# Altium schematic sheet PM3_Bosclone_FPGA_1.SchDoc
size 282 x 200 mm
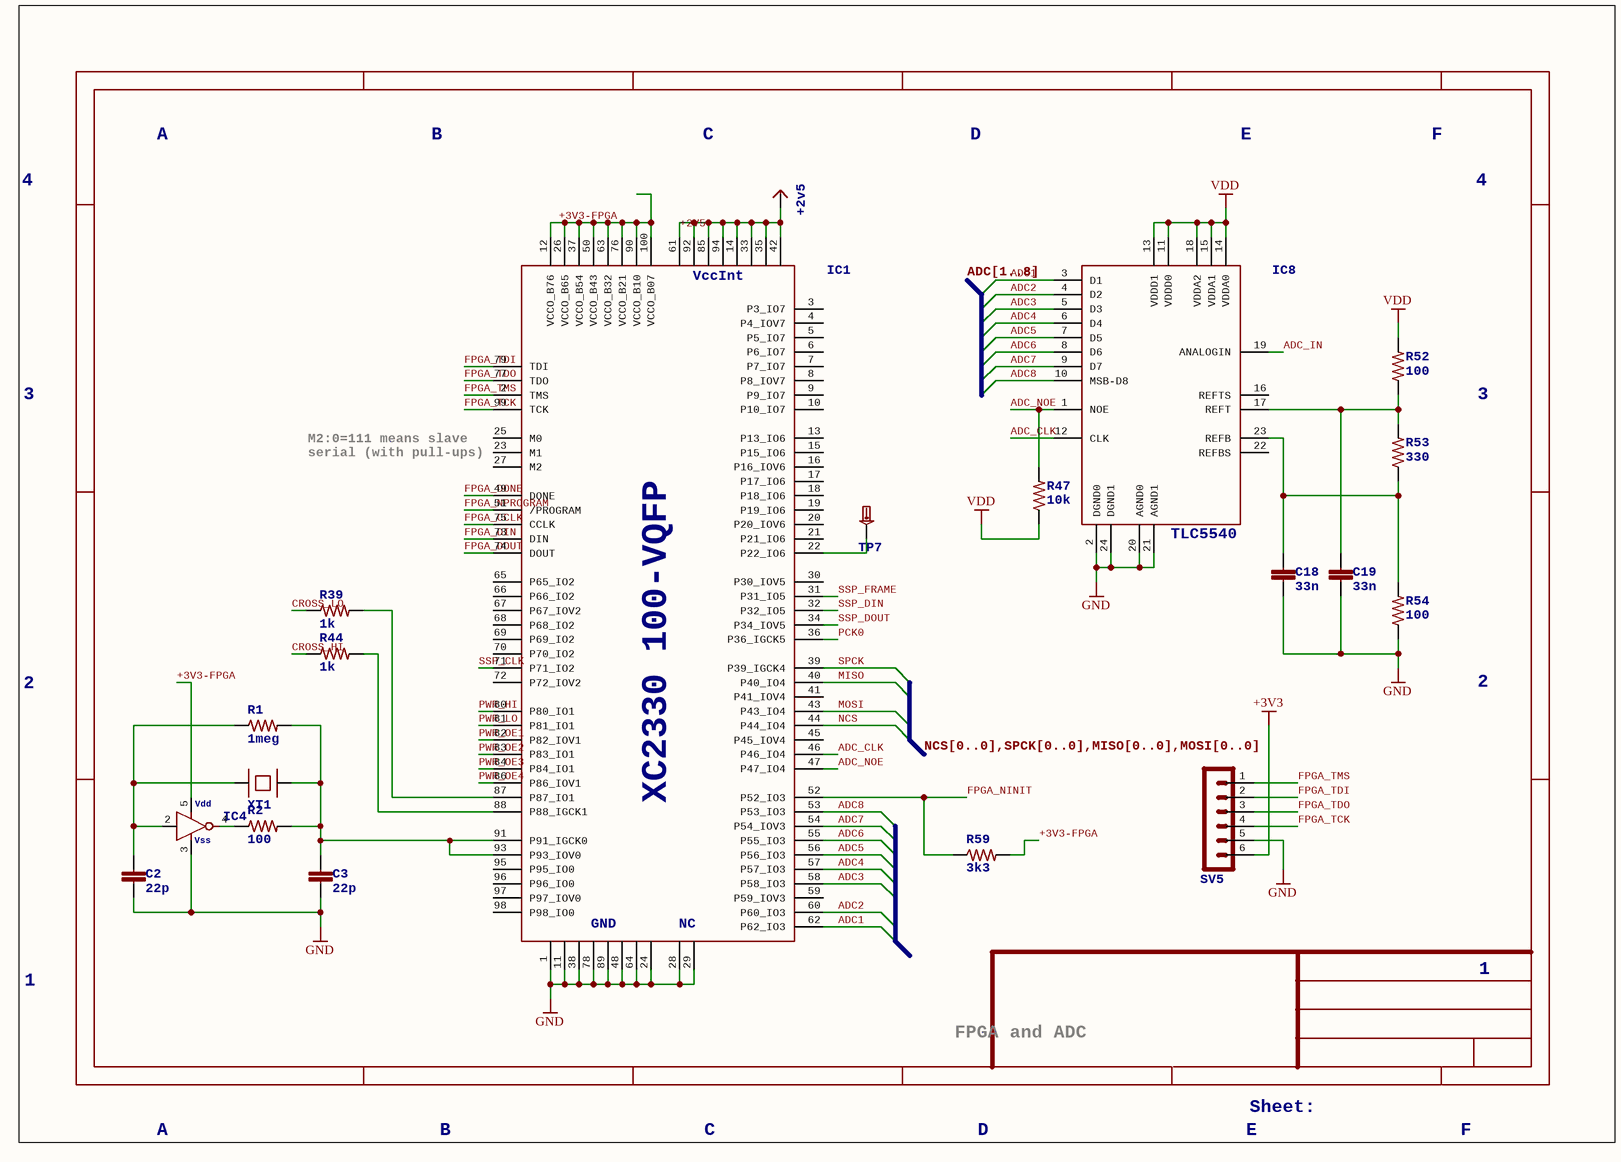
[diagram p0: PM3_Bosclone_FPGA_1.SchDoc]

## Parts
C2  22p  [RLC_0603]
C3  22p  [RLC_0603]
C18  33n  [RLC_0603]
C19  33n  [RLC_0603]
IC1  XC2330100-VQFP: XC2330 100-VQFP  [VQFP-100]  (hidden comment: SPARTAN-II-XC2S30-100-VQFP)
IC4  HCU-INVERTER  [SMV-5]  (value not drawn)
IC8  TLC5540  [TSSOP-24]
R1  1meg  [RLC_0603]
R2  100  [RLC_0603]
R39  1k  [RLC_0603]
R44  1k  [RLC_0603]
R47  10k  [RLC_0603]
R52  100  [RLC_0603]
R53  330  [RLC_0603]
R54  100  [RLC_0603]
R59  3k3  [RLC_0603]
SV5  HEADER-MALE-6X1  [HEADER-MALE-6X1-0.100-UNKEYED]  (value not drawn)
TP7  TESTPADKEYSTONE-SMD  [KEYSTONE-SMD-TESTPOINT-5015]  (value not drawn)
V4  SUPPLY_2V5  (value not drawn)
XT1  XTAL-SMD-CITIZEN-CS10  [XTAL-SMD-CITIZEN-CS10]  (value not drawn)

## Nets
+3V3: SV5.6
GND: C2.2 C3.2 C18.2 C19.2 IC1.1(GND1) IC1.11(GND2) IC1.24(GND8) IC1.28(NC0) IC1.29(NC1) IC1.38(GND3) IC1.48(GND6) IC1.64(GND7) IC1.78(GND4) IC1.89(GND5) IC4.3(VSS) IC8.2(DGND0) IC8.20(AGND0) IC8.21(AGND1) IC8.24(DGND1) R54.1 SV5.5
VDD: IC8.11(VDDD0) IC8.13(VDDD1) IC8.14(VDDA0) IC8.15(VDDA1) IC8.18(VDDA2) R47.1 R52.2
+2V5: IC1.14(VCCINT5) IC1.33(VCCINT6) IC1.35(VCCINT7) IC1.42(VCCINT8) IC1.61(VCCINT1) IC1.85(VCCINT3) IC1.92(VCCINT2) IC1.94(VCCINT4) V4.?1(+2V5)
+3V3-FPGA: IC1.12(VCCO_B76) IC1.26(VCCO_B65) IC1.37(VCCO_B54) IC1.50(VCCO_B43) IC1.63(VCCO_B32) IC1.76(VCCO_B21) IC1.90(VCCO_B10) IC1.100(VCCO_B07) IC4.5(VDD) R59.2
ADC1: IC1.62(P62_IO3) IC8.3(D1)
ADC2: IC1.60(P60_IO3) IC8.4(D2)
ADC3: IC1.58(P58_IO3) IC8.5(D3)
ADC4: IC1.57(P57_IO3) IC8.6(D4)
ADC5: IC1.56(P56_IO3) IC8.7(D5)
ADC6: IC1.55(P55_IO3) IC8.8(D6)
ADC7: IC1.54(P54_IOV3) IC8.9(D7)
ADC8: IC1.53(P53_IO3) IC8.10(MSB-D8)
ADC_CLK: IC1.46(P46_IO4) IC8.12(CLK)
ADC_IN: IC8.19(ANALOGIN)
ADC_NOE: IC1.47(P47_IO4) IC8.1(NOE) R47.2
CROSS_HI: R44.1
CROSS_LO: R39.1
FPGA_CCLK: IC1.75(CCLK)
FPGA_DIN: IC1.73(DIN)
FPGA_DONE: IC1.49(DONE)
FPGA_DOUT: IC1.74(DOUT)
FPGA_NINIT: IC1.52(P52_IO3) R59.1
FPGA_NPROGRAM: IC1.51(/PROGRAM)
FPGA_TCK: IC1.99(TCK) SV5.4
FPGA_TDI: IC1.79(TDI) SV5.2
FPGA_TDO: IC1.77(TDO) SV5.3
FPGA_TMS: IC1.2(TMS) SV5.1
MISO: IC1.40(P40_IO4)
MOSI: IC1.43(P43_IO4)
NCS: IC1.44(P44_IO4)
PCK0: IC1.36(P36_IGCK5)
PWR_HI: IC1.80(P80_IO1)
PWR_LO: IC1.81(P81_IO1)
PWR_OE1: IC1.82(P82_IOV1)
PWR_OE2: IC1.83(P83_IO1)
PWR_OE3: IC1.84(P84_IO1)
PWR_OE4: IC1.86(P86_IOV1)
SPCK: IC1.39(P39_IGCK4)
SSP_CLK: IC1.71(P71_IO2)
SSP_DIN: IC1.32(P32_IO5)
SSP_DOUT: IC1.34(P34_IOV5)
SSP_FRAME: IC1.31(P31_IO5)
NetC2_1: C2.1 IC4.2(A) R1.1 XT1.A
NetC3_1: C3.1 IC1.91(P91_IGCK0) IC1.93(P93_IOV0) R1.2 R2.2 XT1.B
NetC18_1: C18.1 IC8.23(REFB) R53.1 R54.2
NetC19_1: C19.1 IC8.17(REFT) R52.1 R53.2
NetIC1_22: IC1.22(P22_IO6) TP7.1(P$1)
NetIC1_87: IC1.87(P87_IO1) R39.2
NetIC1_88: IC1.88(P88_IGCK1) R44.2
NetIC4_4: IC4.4(Y) R2.1

Not connected (* = marked no-connect by the designer): IC1 3(P3_IO7) 4(P4_IOV7) 5(P5_IO7) 6(P6_IO7) 7(P7_IO7) 8(P8_IOV7) 9(P9_IO7) 10(P10_IO7) 13(P13_IO6) 15(P15_IO6) 16(P16_IOV6) 17(P17_IO6) 18(P18_IO6) 19(P19_IO6) 20(P20_IOV6) 21(P21_IO6) 23(M1) 25(M0) 27(M2) 30(P30_IOV5) 41(P41_IOV4) 45(P45_IOV4) 59(P59_IOV3) 65(P65_IO2) 66(P66_IO2) 67(P67_IOV2) 68(P68_IO2) 69(P69_IO2) 70(P70_IO2) 72(P72_IOV2) 95(P95_IO0) 96(P96_IO0) 97(P97_IOV0) 98(P98_IO0); IC8 16(REFTS) 22(REFBS)

## Buses and harness runs
bus ADC[1..8]
bus NCS[0..0],SPCK[0..0],MISO[0..0],MOSI[0..0]

## Notes on the sheet
- A
- B
- C
- D
- E
- F
- 4
- 3
- M2:0=111 means slave
- serial (with pull-ups)
- 2
- 1
- FPGA and ADC
- Sheet:

## Library data of the parts
C2 C3 C18 C19 = CAPACITOR0603
R1 R2 R39 R44 R47 R52-R54 R59 = RESISTOR0603
IC1 = SPARTAN-II-XC2S30-100-VQFP: VccInt: VccInt; GND: GND; NC: NC
IC4 = HCU-INVERTER: Vdd: Vdd; Vss: Vss
IC8 = TLC5540: TLC5540: TLC5540
V4 = SUPPLY_2V5: +2v5: +2v5